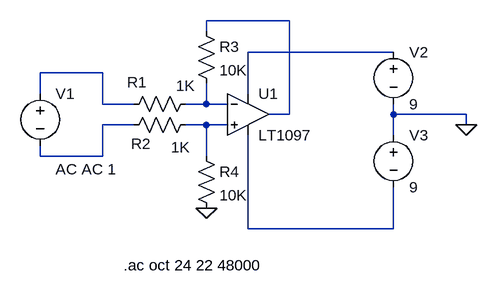
[diagram p0: schematic diff op amp.asc]
diff op amp.asc, the LTspice schematic file:
Version 4
SHEET 1 880 680
WIRE 384 -16 256 -16
WIRE 256 0 256 -16
WIRE 544 32 320 32
WIRE 96 64 0 64
WIRE 0 96 0 64
WIRE 320 96 320 32
WIRE 96 112 96 64
WIRE 144 112 96 112
WIRE 256 112 256 80
WIRE 256 112 224 112
WIRE 288 112 256 112
WIRE 384 128 384 -16
WIRE 384 128 352 128
WIRE 544 128 544 112
WIRE 656 128 544 128
WIRE 144 144 96 144
WIRE 256 144 224 144
WIRE 288 144 256 144
WIRE 656 144 656 128
WIRE 544 160 544 128
WIRE 0 192 0 176
WIRE 96 192 96 144
WIRE 96 192 0 192
WIRE 256 192 256 144
WIRE 320 304 320 160
WIRE 544 304 544 240
WIRE 544 304 320 304
FLAG 656 144 0
FLAG 256 272 0
SYMBOL voltage 0 80 R0
WINDOW 123 24 132 Left 0
WINDOW 39 0 0 Left 0
SYMATTR InstName V1
SYMATTR Value ""
SYMATTR Value2 AC AC 1
SYMBOL Opamps\\LT1097 320 64 R0
SYMATTR InstName U1
SYMBOL res 128 128 R270
WINDOW 0 34 21 VTop 0
WINDOW 3 60 96 VBottom 0
SYMATTR InstName R1
SYMATTR Value 1K
SYMBOL res 240 128 R90
WINDOW 0 61 85 VBottom 0
WINDOW 3 35 24 VTop 0
SYMATTR InstName R2
SYMATTR Value 1K
SYMBOL res 240 -16 R0
SYMATTR InstName R3
SYMATTR Value 10K
SYMBOL res 240 176 R0
SYMATTR InstName R4
SYMATTR Value 10K
SYMBOL voltage 544 16 R0
WINDOW 123 0 0 Left 0
WINDOW 39 0 0 Left 0
SYMATTR InstName V2
SYMATTR Value 9
SYMBOL voltage 544 144 R0
WINDOW 123 0 0 Left 0
WINDOW 39 0 0 Left 0
SYMATTR InstName V3
SYMATTR Value 9
TEXT 128 360 Left 0 !.ac oct 24 22 48000

The netlist it stands for:
* diff op amp.asc
V1 N003 N005 AC AC 1
XU1 N006 N004 N002 N007 N001 LT1097  ; pins In+ In- V+ V- OUT
R1 N003 N004 1K
R2 N006 N005 1K
R3 N001 N004 10K
R4 N006 0 10K
V2 N002 0 9
V3 0 N007 9
.ac oct 24 22 48000
.backanno
.end